# EasyEDA schematic lora usb.json
TITLE: Sheet_1; REV: 1.0; Date: 2022-05-01; Sheet: 1/1; Drawn By: Jingxi_Zhu; Company: Your Company
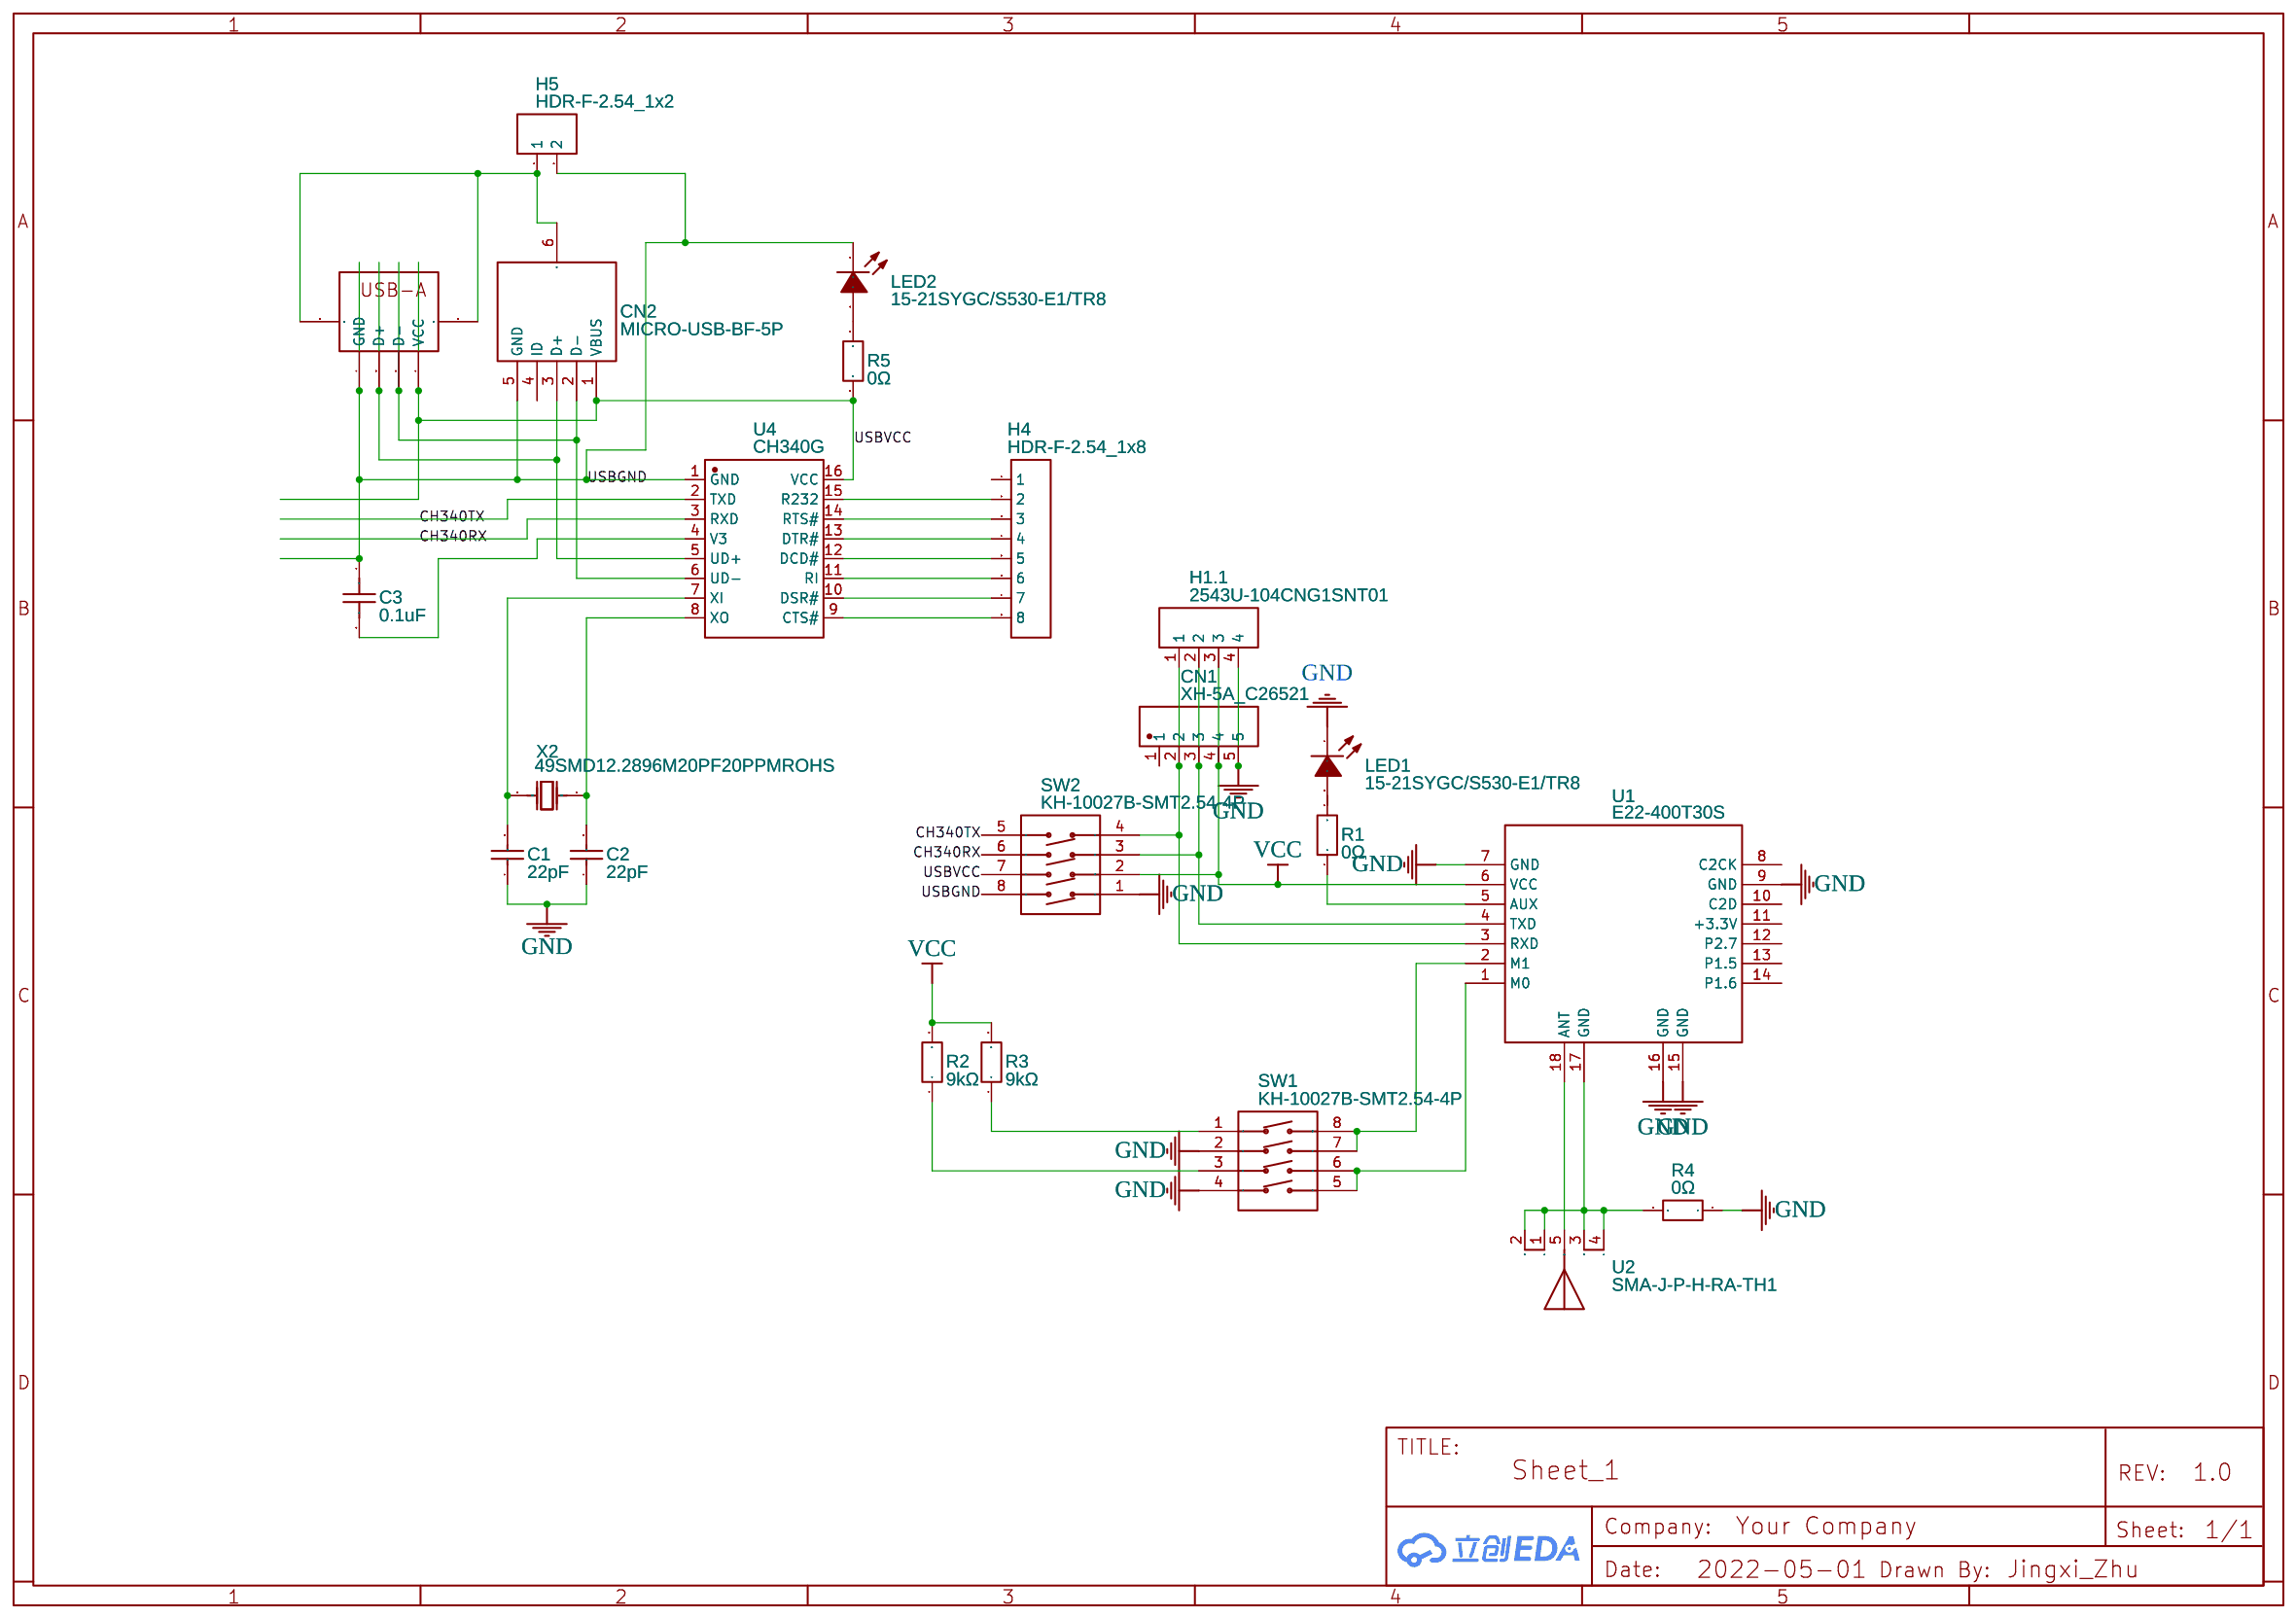
[diagram p0: schematic sheet]

## Parts
C1  22pF  [C0603]
C2  22pF  [C0603]
C3  0.1uF  [C0603]
CN1  XH-5A_C26521  [CONN-TH_5P-P2.50_XH-5A]
CN2  MICRO-USB-BF-5P  [MICRO-USB_FEMALE_A01SB]
H1  2543U-104CNG1SNT01  [HDR-TH_4P-P2.00-V-F]  (section 1)
H4  HDR-F-2.54_1x8  [HDR-F-2.54_1X8]
H5  HDR-F-2.54_1x2  [HDR-F-2.54_1X2]
LED1  15-21SYGC/S530-E1/TR8  [LED1206-RD_GREEN]
LED2  15-21SYGC/S530-E1/TR8  [LED1206-RD_GREEN]
R1  0Ω  [R0805]
R2  9kΩ  [R0603]
R3  9kΩ  [R0603]
R4  0Ω  [R0805]
R5  0Ω  [R0805]
SW1  KH-10027B-SMT2.54-4P  [SW-SMD_KINGHELM_KH-10027B-SMT2.54-4P]
SW2  KH-10027B-SMT2.54-4P  [SW-SMD_KINGHELM_KH-10027B-SMT2.54-4P]
U1  E22-400T30S  [WIRELM-SMD_E22-400T30S]
U2  SMA-J-P-H-RA-TH1  [ANT-TH_SMA-J-P-H-RA-TH1]
U4  CH340G  [SOIC-16_L9.9-W3.9-P1.27-LS6.0-BL]
USB1  USB-A  [USB-A-SMD_USB-A-1-TH]
X2  49SMD12.2896M20PF20PPMROHS  [OSC-SMD_L11.4-W4.5-LS12.5]

## Library data of the parts
C1 C2 = CL10C220JB8NNNC: Supplier: LCSC; Manufacturer: SAMSUNG; Supplier Part: C1653; JLCPCB Part Class: Basic Part
C3 = 0603BB104K500NGT: Supplier: LCSC; Supplier Part: C2168571; Manufacturer: Knowles(楼氏); Contributor: LCSC; JLCPCB Part Class: Extended Part
CN1 = XH-5A_C26521: Supplier Part: C26521; Supplier: LCSC; Manufacturer: ReliaPro; Manufacturer Part: XH-5A; JLCPCB Part Class: Extended Part
CN2 = MICRO-USB-BF-5P: Supplier Part: C46390; Supplier: LCSC; Manufacturer: ValuePro; Manufacturer Part: MICRO 5PFemaleBtype
H1 = 2543U-104CNG1SNT01: Supplier: LCSC; Supplier Part: C350271; Manufacturer: 华宇创; Contributor: LCSC; JLCPCB Part Class: Extended Part; subpart_no: 1
H4 = HDR-F-2.54_1x8: Supplier Part: C225505; Supplier: LCSC; Contributor: LCEDA_Lib
H5 = HDR-F-2.54_1x2: Supplier Part: C49661; Supplier: LCSC; Contributor: LCEDA_Lib
LED1 LED2 = 15-21SYGC/S530-E1/TR8: Supplier: LCSC; Supplier Part: C409439; Manufacturer: Everlight Elec; Contributor: LCSC; JLCPCB Part Class: Extended Part
R1 R4 R5 = ACE05000JT: Supplier: LCSC; Supplier Part: C343926; Manufacturer: Guangdong Fenghua Advanced Tech; Resistance (Ohms): 0; Contributor: LCSC; JLCPCB Part Class: Extended Part
R2 R3 = 0603WAF9001T5E: Supplier: LCSC; Supplier Part: C407505; Manufacturer: Uniroyal Elec; Resistance (Ohms): 9K; Contributor: LCSC; JLCPCB Part Class: Extended Part
SW1 SW2 = KH-10027B-SMT2.54-4P: Supplier: LCSC; Supplier Part: C2842911; Manufacturer: kinghelm(金航标); Contributor: LCSC; JLCPCB Part Class: Extended Part
U1 = E22-400T30S: Supplier: LCSC; Supplier Part: C411288; Manufacturer: Chengdu Ebyte Elec Tech; Contributor: LCSC; JLCPCB Part Class: Extended Part
U2 = SMA-J-P-H-RA-TH1: Supplier: LCSC; Supplier Part: C9900002359; Manufacturer: null; JLCPCB Part Class: Extended Part; Contributor: LCSC
U4 = CH340G: Supplier: LCSC; Manufacturer: WCH; Supplier Part: C14267; JLCPCB Part Class: Extended Part
USB1 = USB-A-A/M Stick plate bent legs VinylPBT With a column: Supplier: LCSC; Manufacturer: ValuePro; Manufacturer Part: A/M Stick plate bent legs VinylPBT With a column; Supplier Part: C46394
X2 = 49SMD12.2896M20PF20PPMROHS: Supplier: LCSC; Manufacturer: LCSC; Supplier Part: C52074

## Nets
GND: C1.1 C2.1 CN1.5 H1.4 LED1.1(-) R4.1 SW1.2 SW1.4 SW2.1 U1.7(GND) U1.9(GND) U1.15(GND) U1.16(GND)
VCC: CN1.4 H1.3 R2.2 R3.2 SW2.2 U1.6(VCC)
CH340RX: SW2.6 U4.3(RXD)
CH340TX: SW2.5 U4.2(TXD)
USBGND: C3.1 CN2.5(GND) H5.2 LED2.1(-) SW2.8 U4.1(GND) USB1.4(GND)
USBVCC: CN2.1(VBUS) R5.2 SW2.7 U4.16(VCC) USB1.1(VCC)
Net-(C1-2): C1.2 U4.7(XI) X2.2(OSC2)
Net-(C2-2): C2.2 U4.8(XO) X2.1(OSC1)
Net-(C3-2): C3.2 U4.4(V3)
Net-(CN1-2): CN1.2 H1.1 SW2.4 U1.3(RXD)
Net-(CN1-3): CN1.3 H1.2 SW2.3 U1.4(TXD)
Net-(CN2-2): CN2.2(D-) U4.6(UD-) USB1.2(D-)
Net-(CN2-3): CN2.3(D+) U4.5(UD+) USB1.3(D+)
Net-(CN2-6): CN2.6(EH) H5.1 USB1.5 USB1.6
Net-(H4-2): H4.2 U4.15(R232)
Net-(H4-3): H4.3 U4.14(RTS#)
Net-(H4-4): H4.4 U4.13(DTR#)
Net-(H4-5): H4.5 U4.12(DCD#)
Net-(H4-6): H4.6 U4.11(RI)
Net-(H4-7): H4.7 U4.10(DSR#)
Net-(H4-8): H4.8 U4.9(CTS#)
Net-(LED1-2): LED1.2(+) R1.2
Net-(LED2-2): LED2.2(+) R5.1
Net-(R1-1): R1.1 U1.5(AUX)
Net-(R2-1): R2.1 SW1.3
Net-(R3-1): R3.1 SW1.1
Net-(R4-2): R4.2 U1.17(GND) U2.1 U2.2 U2.3 U2.4
Net-(SW1-5): SW1.5 SW1.6 U1.1(M0)
Net-(SW1-7): SW1.7 SW1.8 U1.2(M1)
Net-(U1-18): U1.18(ANT) U2.5

Not connected (* = marked no-connect by the designer): CN1 1; CN2 4(ID); H4 1; U1 8(C2CK) 10(C2D) 11(+3.3V) 12(P2.7) 13(P1.5) 14(P1.6)
